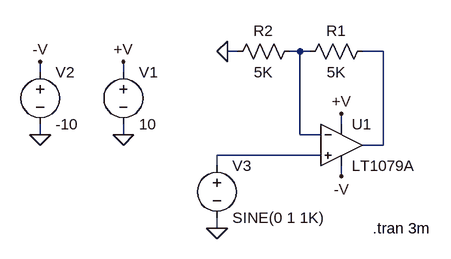
[diagram p0: schematic 1079A.asc]
1079A.asc, the LTspice schematic file:
Version 4
SHEET 1 896 680
WIRE 32 96 16 96
WIRE 128 96 112 96
WIRE 144 96 128 96
WIRE 256 96 224 96
WIRE -272 128 -272 112
WIRE -144 128 -144 112
WIRE 192 208 192 192
WIRE -272 224 -272 208
WIRE -144 224 -144 208
WIRE 128 224 128 96
WIRE 160 224 128 224
WIRE 256 240 256 96
WIRE 256 240 224 240
WIRE 160 256 0 256
WIRE 0 272 0 256
WIRE 192 288 192 272
WIRE 0 368 0 352
FLAG -144 224 0
FLAG 192 192 +V
FLAG -144 112 +V
FLAG 192 288 -V
FLAG -272 224 0
FLAG -272 112 -V
FLAG 16 96 0
FLAG 0 368 0
SYMBOL voltage -144 112 R0
SYMATTR InstName V1
SYMATTR Value 10
SYMBOL voltage -272 112 R0
SYMATTR InstName V2
SYMATTR Value -10
SYMBOL res 240 80 R90
WINDOW 0 0 56 VBottom 2
WINDOW 3 32 56 VTop 2
SYMATTR InstName R1
SYMATTR Value 5K
SYMBOL res 128 80 R90
WINDOW 0 0 56 VBottom 2
WINDOW 3 32 56 VTop 2
SYMATTR InstName R2
SYMATTR Value 5K
SYMBOL voltage 0 256 R0
SYMATTR InstName V3
SYMATTR Value SINE(0 1 1K)
SYMBOL opamps\\LT1079A 192 176 R0
SYMATTR InstName U1
TEXT 240 368 Left 2 !.tran 3m

The netlist it stands for:
* 1079A.asc
V1 +V 0 10
V2 -V 0 -10
R1 N002 N001 5K
R2 N001 0 5K
V3 N003 0 SINE(0 1 1K)
XU1 N003 N001 +V -V N002 LT1079A  ; pins In+ In- V+ V- OUT
.tran 3m
.backanno
.end